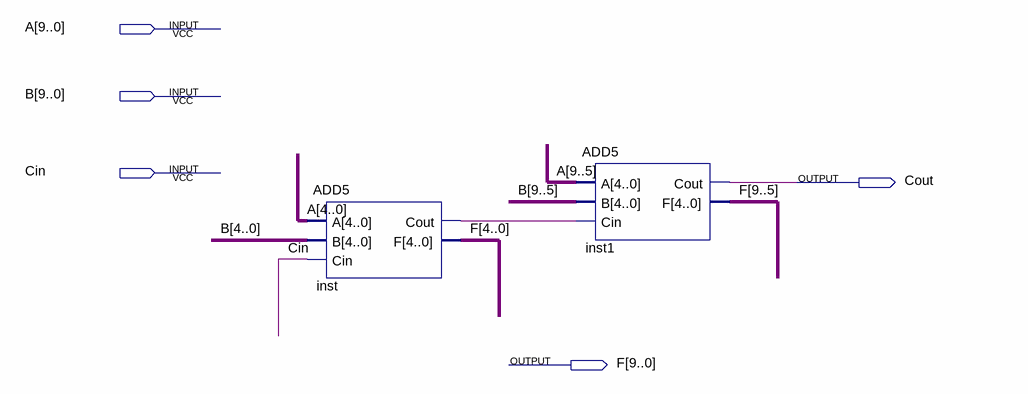
[diagram p0: schematic sheet]
// Quartus schematic ADD10.bdf as structural Verilog: 2 symbols, 5 pins
module ADD10 (
  input  [9:0] A,
  input  [9:0] B,
  input  Cin,
  output Cout,
  output [9:0] F
);

  wire inst_cout;

  ADD5 inst (.A(A[4:0]), .B(B[4:0]), .Cin(Cin), .Cout(inst_cout), .F(F[4:0]));
  ADD5 inst1 (.A(A[9:5]), .B(B[9:5]), .Cin(inst_cout), .Cout(Cout), .F(F[9:5]));
endmodule
